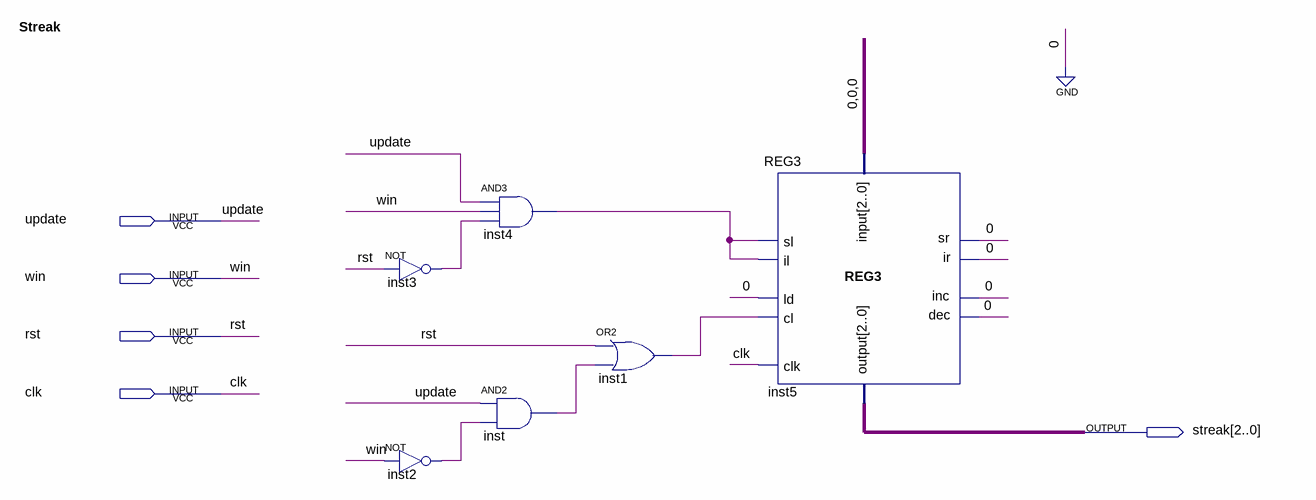
[diagram p0: schematic sheet]
// Quartus schematic Streak.bdf as structural Verilog: 6 symbols, 5 pins
module Streak (
  input  update,
  input  win,
  input  rst,
  input  clk,
  output [2:0] streak
);

  wire inst1_out, inst2_out, inst3_out, inst4_out, inst_out;

  not inst3 (inst3_out, rst);
  not inst2 (inst2_out, win);
  and inst4 (inst4_out, update, win, inst3_out);
  and inst (inst_out, update, inst2_out);
  or inst1 (inst1_out, rst, inst_out);
  REG3 inst5 (
    .clk(clk), .ld(1'b0), .\input (3'b000), .sr(1'b0), .ir(1'b0), .sl(inst4_out), .il(inst4_out), .inc(1'b0),
    .dec(1'b0), .cl(inst1_out), .\output (streak));

  // Notes on the sheet:
  //   Streak
endmodule
